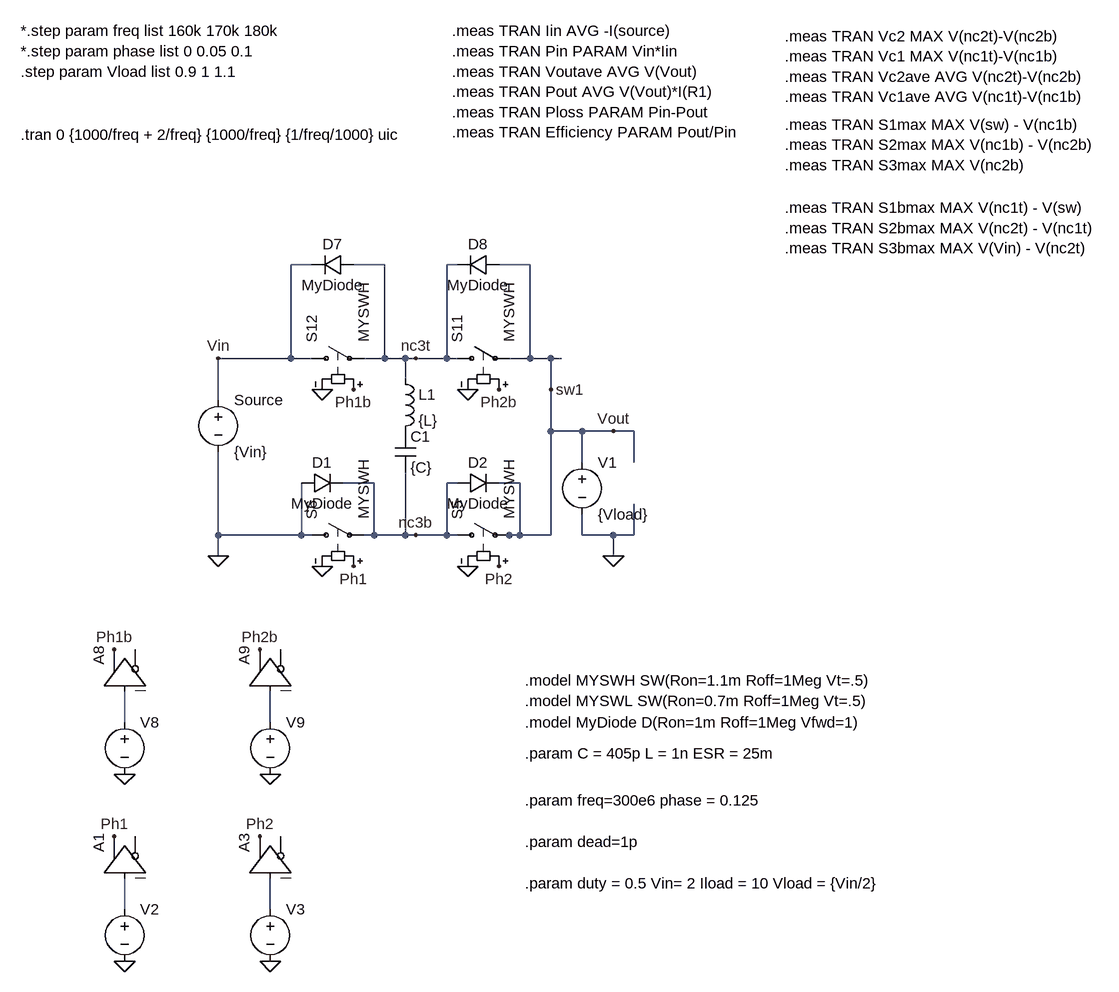
[diagram p0: schematic regulation_by_resonance.asc]
regulation_by_resonance.asc, the LTspice schematic file:
Version 4
SHEET 1 1904 1716
WIRE -848 32 -880 32
WIRE -736 32 -784 32
WIRE -624 32 -640 32
WIRE -512 32 -560 32
WIRE -880 176 -880 32
WIRE -880 176 -992 176
WIRE -848 176 -880 176
WIRE -736 176 -736 32
WIRE -736 176 -768 176
WIRE -704 176 -736 176
WIRE -688 176 -704 176
WIRE -640 176 -640 32
WIRE -640 176 -688 176
WIRE -624 176 -640 176
WIRE -512 176 -512 32
WIRE -512 176 -544 176
WIRE -480 176 -512 176
WIRE -464 176 -480 176
WIRE -704 208 -704 176
WIRE -480 224 -480 176
WIRE -992 240 -992 176
WIRE -480 288 -480 224
WIRE -432 288 -480 288
WIRE -384 288 -432 288
WIRE -352 288 -384 288
WIRE -432 336 -432 288
WIRE -352 336 -352 288
WIRE -752 368 -800 368
WIRE -624 368 -640 368
WIRE -528 368 -560 368
WIRE -992 448 -992 320
WIRE -864 448 -864 368
WIRE -864 448 -992 448
WIRE -848 448 -864 448
WIRE -752 448 -752 368
WIRE -752 448 -768 448
WIRE -704 448 -704 352
WIRE -704 448 -752 448
WIRE -688 448 -704 448
WIRE -640 448 -640 368
WIRE -640 448 -688 448
WIRE -624 448 -640 448
WIRE -544 448 -560 448
WIRE -528 448 -528 368
WIRE -528 448 -544 448
WIRE -480 448 -480 288
WIRE -480 448 -528 448
WIRE -432 448 -432 416
WIRE -384 448 -432 448
WIRE -352 448 -352 400
WIRE -352 448 -384 448
WIRE -992 480 -992 448
WIRE -384 480 -384 448
WIRE -1136 736 -1136 688
WIRE -912 736 -912 688
WIRE -1136 1024 -1136 976
WIRE -912 1024 -912 976
FLAG -1136 1104 0
FLAG -1152 912 Ph1
FLAG -992 176 Vin
FLAG -560 224 Ph2b
FLAG -784 224 Ph1b
FLAG -832 224 0
FLAG -608 224 0
FLAG -912 1104 0
FLAG -928 912 Ph2
FLAG -560 496 Ph2
FLAG -784 496 Ph1
FLAG -832 496 0
FLAG -608 496 0
FLAG -384 480 0
FLAG -992 480 0
FLAG -1136 816 0
FLAG -1152 624 Ph1b
FLAG -912 816 0
FLAG -928 624 Ph2b
FLAG -688 176 nc3t
FLAG -688 448 nc3b
FLAG -384 288 Vout
FLAG -480 224 sw1
SYMBOL voltage -1136 1008 R0
WINDOW 123 0 0 Left 2
WINDOW 39 0 0 Left 2
WINDOW 3 24 96 Invisible 2
SYMATTR Value PULSE(0 1 {phase/freq} 1p 1p {1/freq/2 - dead*2} {1/freq})
SYMATTR InstName V2
SYMBOL Digital\\buf -1200 976 R270
SYMATTR InstName A1
SYMBOL voltage -992 224 R0
WINDOW 123 0 0 Left 2
WINDOW 39 0 0 Left 2
SYMATTR InstName Source
SYMATTR Value {Vin}
SYMBOL sw -640 176 R270
SYMATTR InstName S11
SYMATTR Value MYSWH
SYMBOL sw -864 176 R270
SYMATTR InstName S12
SYMATTR Value MYSWH
SYMBOL voltage -912 1008 R0
WINDOW 123 0 0 Left 2
WINDOW 39 0 0 Left 2
WINDOW 3 24 96 Invisible 2
SYMATTR Value PULSE(0 1 {1/freq/2+phase/freq} 1p 1p {1/freq/2-dead*2} {1/freq})
SYMATTR InstName V3
SYMBOL Digital\\buf -976 976 R270
SYMATTR InstName A3
SYMBOL sw -640 448 R270
SYMATTR InstName S5
SYMATTR Value MYSWH
SYMBOL sw -864 448 R270
SYMATTR InstName S6
SYMATTR Value MYSWH
SYMBOL cap -720 288 R0
SYMATTR InstName C1
SYMATTR Value {C}
SYMATTR SpiceLine Rser={ESR}
SYMATTR SpiceLine2 IC={Vin/2}
SYMBOL voltage -1136 720 R0
WINDOW 123 0 0 Left 2
WINDOW 39 0 0 Left 2
WINDOW 3 24 96 Invisible 2
SYMATTR Value PULSE(0 1 {1/freq/2+dead} 1p 1p {1/freq/2-dead*2} {1/freq})
SYMATTR InstName V8
SYMBOL Digital\\buf -1200 688 R270
SYMATTR InstName A8
SYMBOL voltage -912 720 R0
WINDOW 123 0 0 Left 2
WINDOW 39 0 0 Left 2
WINDOW 3 24 96 Invisible 2
SYMATTR Value PULSE(0 1 {dead} 1p 1p {1/freq/2-dead*2} {1/freq})
SYMATTR InstName V9
SYMBOL Digital\\buf -976 688 R270
SYMATTR InstName A9
SYMBOL diode -864 384 R270
WINDOW 0 32 32 VTop 2
WINDOW 3 0 32 VBottom 2
SYMATTR InstName D1
SYMATTR Value MyDiode
SYMBOL diode -624 384 R270
WINDOW 0 32 32 VTop 2
WINDOW 3 0 32 VBottom 2
SYMATTR InstName D2
SYMATTR Value MyDiode
SYMBOL diode -784 16 R90
WINDOW 0 0 32 VBottom 2
WINDOW 3 32 32 VTop 2
SYMATTR InstName D7
SYMATTR Value MyDiode
SYMBOL diode -560 16 R90
WINDOW 0 0 32 VBottom 2
WINDOW 3 32 32 VTop 2
SYMATTR InstName D8
SYMATTR Value MyDiode
SYMBOL ind -720 192 R0
SYMATTR InstName L1
SYMATTR Value {L}
SYMATTR SpiceLine Rser=0.2m Rpar=1k
SYMBOL voltage -432 320 R0
SYMATTR InstName V1
SYMATTR Value {Vload}
TEXT -1296 -168 Left 2 !.tran 0 {1000/freq + 2/freq} {1000/freq} {1/freq/1000} uic
TEXT -520 672 Left 2 !.model MYSWH SW(Ron=1.1m Roff=1Meg Vt=.5)\n.model MYSWL SW(Ron=0.7m Roff=1Meg Vt=.5)
TEXT -520 736 Left 2 !.model MyDiode D(Ron=1m Roff=1Meg Vfwd=1)
TEXT -520 856 Left 2 !.param freq=300e6 phase = 0.125
TEXT -520 984 Left 2 !.param duty = 0.5 Vin= 2 Iload = 10 Vload = {Vin/2}
TEXT -520 920 Left 2 !.param dead=1p
TEXT -520 784 Left 2 !.param C = 405p L = 1n ESR = 25m
TEXT -120 -184 Left 2 !.meas TRAN S1max MAX V(sw) - V(nc1b)\n.meas TRAN S2max MAX V(nc1b) - V(nc2b)\n.meas TRAN S3max MAX V(nc2b)
TEXT -120 -320 Left 2 !.meas TRAN Vc2 MAX V(nc2t)-V(nc2b)\n.meas TRAN Vc1 MAX V(nc1t)-V(nc1b)\n.meas TRAN Vc2ave AVG V(nc2t)-V(nc2b)\n.meas TRAN Vc1ave AVG V(nc1t)-V(nc1b)
TEXT -120 -56 Left 2 !.meas TRAN S1bmax MAX V(nc1t) - V(sw) \n.meas TRAN S2bmax MAX V(nc2t) - V(nc1t) \n.meas TRAN S3bmax MAX V(Vin) - V(nc2t)
TEXT -1296 -328 Left 2 !*.step param freq list 160k 170k 180k\n*.step param phase list 0 0.05 0.1\n.step param Vload list 0.9 1 1.1
TEXT -632 -328 Left 2 !.meas TRAN Iin AVG -I(source)\n.meas TRAN Pin PARAM Vin*Iin\n.meas TRAN Voutave AVG V(Vout)\n.meas TRAN Pout AVG V(Vout)*I(R1)\n.meas TRAN Ploss PARAM Pin-Pout\n.meas TRAN Efficiency PARAM Pout/Pin

The netlist it stands for:
* regulation_by_resonance.asc
V2 N003 0 PULSE(0 1 {phase/freq} 1p 1p {1/freq/2 - dead*2} {1/freq})
A1 N003 0 0 0 0 0 Ph1 0 BUF
V§Source Vin 0 {Vin}
S11 nc3t sw1 Ph2b 0 MYSWH
S12 Vin nc3t Ph1b 0 MYSWH
V3 N004 0 PULSE(0 1 {1/freq/2+phase/freq} 1p 1p {1/freq/2-dead*2} {1/freq})
A3 N004 0 0 0 0 0 Ph2 0 BUF
S5 nc3b sw1 Ph2 0 MYSWH
S6 0 nc3b Ph1 0 MYSWH
C1 P001 nc3b {C} Rser={ESR} IC={Vin/2}
V8 N001 0 PULSE(0 1 {1/freq/2+dead} 1p 1p {1/freq/2-dead*2} {1/freq})
A8 N001 0 0 0 0 0 Ph1b 0 BUF
V9 N002 0 PULSE(0 1 {dead} 1p 1p {1/freq/2-dead*2} {1/freq})
A9 N002 0 0 0 0 0 Ph2b 0 BUF
D1 0 nc3b MyDiode
D2 nc3b sw1 MyDiode
D7 nc3t Vin MyDiode
D8 sw1 nc3t MyDiode
L1 nc3t P001 {L} Rser=0.2m Rpar=1k
V1 sw1 0 {Vload}
.model D D
.lib standard.dio
.tran 0 {1000/freq + 2/freq} {1000/freq} {1/freq/1000} uic
.model MYSWH SW(Ron=1.1m Roff=1Meg Vt=.5)
.model MYSWL SW(Ron=0.7m Roff=1Meg Vt=.5)
.model MyDiode D(Ron=1m Roff=1Meg Vfwd=1)
.param freq=300e6 phase = 0.125
.param duty = 0.5 Vin= 2 Iload = 10 Vload = {Vin/2}
.param dead=1p
.param C = 405p L = 1n ESR = 25m
.meas TRAN S1max MAX V(sw) - V(nc1b)
.meas TRAN S2max MAX V(nc1b) - V(nc2b)
.meas TRAN S3max MAX V(nc2b)
.meas TRAN Vc2 MAX V(nc2t)-V(nc2b)
.meas TRAN Vc1 MAX V(nc1t)-V(nc1b)
.meas TRAN Vc2ave AVG V(nc2t)-V(nc2b)
.meas TRAN Vc1ave AVG V(nc1t)-V(nc1b)
.meas TRAN S1bmax MAX V(nc1t) - V(sw)
.meas TRAN S2bmax MAX V(nc2t) - V(nc1t)
.meas TRAN S3bmax MAX V(Vin) - V(nc2t)
*.step param freq list 160k 170k 180k
*.step param phase list 0 0.05 0.1
.step param Vload list 0.9 1 1.1
.meas TRAN Iin AVG -I(source)
.meas TRAN Pin PARAM Vin*Iin
.meas TRAN Voutave AVG V(Vout)
.meas TRAN Pout AVG V(Vout)*I(R1)
.meas TRAN Ploss PARAM Pin-Pout
.meas TRAN Efficiency PARAM Pout/Pin
.backanno
.end